# Altium schematic sheet Power_Supply.SchDoc
size 431 x 279 mm; SheetNumber: 6; SheetTotal: 6
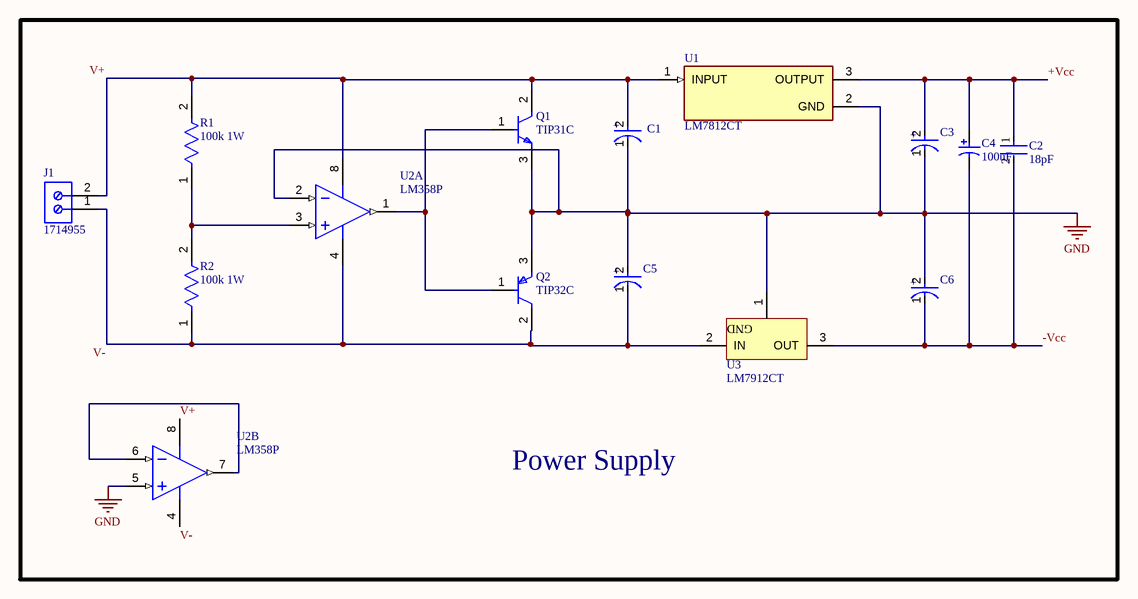
[diagram p0: Power_Supply.SchDoc]

## Parts
C1  EEUFC1H4R7B  [FP-RAD-TH-D_5_0_5-L_11_1-MFG]  (value not drawn)
C2  18pF  [FP-F471K33Y5RP6UK5R-MFG]
C3  EEUFC1H4R7B  [FP-RAD-TH-D_5_0_5-L_11_1-MFG]  (value not drawn)
C4  100uF  [CAPPR65-350-1150X800X1250]
C5  EEUFC1H4R7B  [FP-RAD-TH-D_5_0_5-L_11_1-MFG]  (value not drawn)
C6  EEUFC1H4R7B  [FP-RAD-TH-D_5_0_5-L_11_1-MFG]  (value not drawn)
J1  1714955  [PHOE-1714955_V]
Q1  TIP31C  [FP-TO-220-P0A0015988-MFG]
Q2  TIP32C  [FP-TO-220-P0A0015988-MFG]
R1  100k 1W  [FP-RR01-MFG]
R2  100k 1W  [FP-RR01-MFG]
U1  LM7812CT  [FP-TO220B03-MFG]
U2  LM358P  [P0008A]  (parts A,B of 2)
U3  LM7912CT  [NDE0003A]

## Blocks framed on the sheet
Power Supply: C1-C6 J1 Q1 Q2 R1 R2 U1-U3

## Nets
GND: C1.1(C) C3.1(C) C5.2(A) C6.2(A) Q1.3(E) Q2.3(E) U1.2(GND) U2.2(1IN-) U2.5(2IN+) U3.1(GND)
+Vcc: C2.1 C3.2(A) C4.1 U1.3(OUTPUT)
-Vcc: C2.2 C4.2 C6.1(C) U3.3(OUT)
V+: C1.2(A) J1.2 Q1.2(C) R1.2 U1.1(INPUT) U2.8(VCC)
V-: C5.1(C) J1.1 Q2.2(C) R2.1 U2.4(GND) U3.2(IN)
NetQ1_1: Q1.1(B) Q2.1(B) U2.1(1OUT)
NetR1_1: R1.1 R2.2 U2.3(1IN+)
NetU2_6: U2.6(2IN-) U2.7(2OUT)

## Notes on the sheet
- DWG. NO.
- REV.
- SHT.
- THIS DOCUMENT AND THE DATA DISCLOSED HEREIN OR HEREWITH IS THE PROPERTY OF ALTIUM LIMITED AND MAY BE FREELY DISTRIBUTED IN WHOLE. NO RIGHTS ARE RESERVED OR EXPRESS OR IMPLIED WARANTEE GIVEN.
- REVISION
- DESCRIPTION
- DATE
- APPROVED
- ENG:
- APPROVALS
- PROJECT
- DSN:
- CHK:
- REFERENCE DOCUMENTS
- PROJECT REVISION:
- TITLE
- DOCUMENT REVISION:
- DESIGN ITEM:
- BOM:
- FAB DWG:
- PCB DWG:
- ASSY DWG:
- SCALE:
- SIZE
- B
- CAGE CODE
- FILE NAME
- DWG NO.
- SHEET
- OF
- REV
- (in symbol CMP-05427-000609-1) +

## Library data of the parts
C1 C3 C5 C6 = CMP-05427-000609-1: Aluminum Electrolytic Capacitors (Radial Lead Type) AEC-Q200 Qualified 4.7uF ±20% 50V; Impedance: 1.3R; Life (Hours): 1000Hour; Polarity: Polar; Lead Diameter: 0.5mm; Ripple Current: 95mA; Ratings: AEC-Q200; Voltage Rating (DC): 50V; Voltage Rating: 50V; Lead Pitch: 5mm; Features: General Purpose; Height: 11mm; Radiation Hardening: No; Diameter: 5mm; Termination: Radial; Length: 11mm; Min Operating Temperature: -55°C; Height - Seated (Max): 0.472inch; Packaging: Tape and Reel; Max Operating Temperature: 105°C; ESR (Equivalent Series Resistance): 1.3R; RoHS Compliant: Yes; Package Quantity: 2000; Mount: Through Hole; Tolerance: 20%; Series: FC; Case/Package: Radial; Contact Plating: Tin
C2 = CMP-02417-000080-1: CAP CER 470PF 2KV Y5R RADIAL; Tolerance: 10%; Dielectric Material: Ceramic; Insulation Resistance: 10GR; Lead/Base Style: Kinked; Lead Diameter: 0.8mm; Series: F; Depth: 5mm; Package Quantity: 1500; Resistor Type: Ceramic; Construction: RADIAL; Min Operating Temperature: -30°C; Mount: Through Hole; Radiation Hardening: No; Voltage: 2kV; Voltage Rating: 2kV; Max Operating Temperature: 125°C; Termination: Radial; RoHS Compliant: Yes; Lead Pitch: 5mm; Capacitance: 470pF; Packaging: Tape and Reel; Length: 8.5mm; Case/Package: Radial; Dielectric: Y5R
C4 = CMP-1665-00042-2: Aluminum Electrolytic Capacitor, 100 uF, +/- 20%, 50 V, -40 to 85 degC, 2-Pin THD, RoHS, Bulk; Manufacturer: Panasonic; Lead Diameter: 0.6mm; Dielectric Material: Aluminium; Voltage Rating (DC): 50V; Ripple Current (AC): 250mA; Polarity: Polar; Leakage Current: 3uA; Life (Hours): 2000Hour; Lead/Base Style: Straight; Dissipation Factor: 0.12%; Radiation Hardening: No; Height: 11.5mm; Package Quantity: 200; Package Reference: CAPPR65-350-1150X800X1250; Min Operating Temperature: -40degC; Mount: ThroughHole; Package Description: 2-Pin Radial Lead, Dia 8 mm, Height 12.5 mm; Case/Package: Radial; Diameter: 8mm; Voltage Rating: 50V; Length: 11.5mm; REACH SVHC: NoSVHC; Height - Seated (Max): 0.492inch; Datasheet URL: https://industrial.panasonic.com/cdbs/www-data/pdf/RDF0000/ABA0000C1218.pdf; RoHSCompliant: true; Ripple Current: 250mA; Lead Free: LeadFree; Voltage: 50V; Manufacturer URL: http://www.panasonic.com/; Number of Pins: 2; Datasheet Version: Rev. 05, 10/2016; Packaging: Bulk; Termination: Radial; Max Operating Temperature: 85degC; Tolerance: 20%; Capacitance: 100uF; Lead Pitch: 3.5mm
J1 = CMP-2000-05797-1: PC Terminal Block, Pitch 6.35 mm, 1 x 2 Position, Height 21.5 mm, Tail Lenght 5.1 mm, RoHS, Bulk; Manufacturer: Phoenix Contact; Package Description: PC Terminal Block, Pitch 6.35 mm, 1 x 2 Position, Height 21.5 mm, Tail Lenght 5.1 mm; Datasheet URL: http://media.digikey.com/pdf/Data%20Sheets/Phoenix%20Contact%20PDFs/1714955.pdf; Package Reference: 1714955; Manufacturer URL: http://www.phoenixcontact.com/; Datasheet Version: 02/2010; Mounting Technology: ThroughHole
Q1 = CMP-12195-000001-1: TRANS NPN 100V 3A TO-220; Manufacturer: STMicroelectronics; Hfe Max: 50; Number Of Npn: 1; Max Junction Temp: +150°C; Standoff Height: 3.5mm; Emitter Base Voltage: 5V; Collector Emitter Saturation Voltage: 1.2V; Power Dissipation: 2W; Hfe Testvce: 4V; Hfe Min: 10; Device Class L2: Transistors; ComponentLink2URL: https://www.st.com/resource/en/datasheet/tip31c.pdf; Device Class L1: Discrete Semiconductors; Digikey Description: TRANS NPN 100V 3A TO-220; Max Collector Current: 3A; RoHS: TRUE; Height: 19.68mm; Mouser Description: Bipolar Transistors - BJT NPN Gen Pur Power; Number Of Elements: 1; Package: TO-220-P0A0015988; Temperature: to +150°C; Octopart: https://octopart.com/tip31c-stmicroelectronics-15555; Manufacturer Part Number: TIP31C; Category: Trans; Hfe Testic: 3A; Lead Free: Yes; Collector Base Voltage: 100V; Device Class L3: BJTs; Collector Emitter Voltage: 100V; Automotive: No; ComponentLink2Description: Datasheet; Temperature Range High: +150°C
Q2 = CMP-12195-000005-1: TRANS PNP 100V 3A TO-220; Manufacturer: STMicroelectronics; Standoff Height: 3.5mm; Number Of Pnp: 1; Max Collector Current: -3A; Emitter Base Voltage: -5V; Collector Emitter Voltage: -100V; Hfe Testvce: -4V; Hfe Max: 50; Collector Emitter Saturation Voltage: -1.2V; Power Dissipation: 2W; Max Junction Temp: +150°C; Hfe Min: 10; Device Class L3: BJTs; Mouser Description: Original ST Microelectronics Transistor, 100V, 3A, .22 Ohm, TO-220 Package; ComponentLink2Description: Datasheet; Device Class L1: Discrete Semiconductors; Automotive: No; Number Of Elements: 1; Category: Trans; Collector Base Voltage: -100V; Package: TO-220-P0A0015988; Height: 19.68mm; Lead Free: Yes; ComponentLink2URL: https://www.st.com/resource/en/datasheet/tip32c.pdf; Hfe Testic: -3A; RoHS: TRUE; Temperature Range High: +150°C; Temperature: to +150°C; Device Class L2: Transistors; Digikey Description: TRANS PNP 100V 3A TO-220; Octopart: https://octopart.com/tip32c-stmicroelectronics-353617; Manufacturer Part Number: TIP32C
R1 R2 = CMP-03212-000008-1: RES 100K OHM 5% 1W AXIAL; Number of Resistors: 1; Temperature Coefficient: 300ppm/°C; Voltage Rating: 350V; Resistance: 100kR; Package Quantity: 5000; Power Rating: 1W; Packaging: Ammo Pack; Min Operating Temperature: -55°C; Number of Terminations: 2; Resistor Type: Power resistor; Length: 6.8mm; ELV: Compliant; Mount: Axial; RoHS Compliant: Yes; Case/Package: Metal; Diameter: 2.6mm; Termination: Axial; Series: RR; Max Operating Temperature: 155°C; Tolerance: 5%
U1 = CMP-07128-000015-1: IC REG LINEAR 12V 1A TO220-3; Obsolete Part: true; Manufacturer: ON Semiconductor; Nominal Supply Current: 5.1mA; Output Type: Fixed; Dropout Voltage: 2V; Max Supply Voltage: 35V; Accuracy Percentage: 4%; Standoff Height: 2.7mm; Number Of Outputs: 1; Octopart: https://octopart.com/lm7812ct-on+semiconductor-14383031; Output Current: 1A; ComponentLink2Description: Datasheet; Device Class L1: Integrated Circuits (ICs); Device Class L2: Power Management ICs; Temperature Range Low: -40°C; Category: IC; Package: TO220B03; Device Class L3: Voltage Regulators - Linear; RoHS: TRUE; Digikey Description: IC REG LINEAR 12V 1A TO220-3; Ipc Land Pattern Name: TO-220; Output Voltage: 12V; Temperature: -40°C to +125°C; Automotive: No; Temperature Range High: +125°C; ComponentLink2URL: https://www.mouser.in/datasheet/2/308/LM7812-1125088.pdf; Manufacturer Part Number: LM7812CT; Height: 20.4mm; Lead Free: Yes
U2 = CMP-2000-06549-1: Dual Operational Amplifier, 3 to 32 V, 0 to 70 degC, 8-Pin PDIP (P), RoHS, Tape and Reel; Manufacturer: Technik Industrial; Datasheet Version: Rev. T, 04/2015; Datasheet URL: http://www.ti.com/lit/ds/symlink/lm358.pdf; Manufacturer URL: http://www.technik.com.hk/; Package Description: 8-Pin Double In-line Package, Body 9.59 x 6.35 mm, Pitch 2.54 mm; Mounting Technology: ThroughHole; Package URL: http://www.ti.com/lit/ml/mpdi001b/mpdi001b.pdf; Package Reference: P8
U3 = CMP-0062-02472-3: 3-Terminal Negative Regulator, 3-pin TO-220; Manufacturer: Texas Instruments; CompType: LDO IC; PowerWise: N; PackageTopMarking: NSUZXYTTE#*LM7912CT; PinCount: 3; RoHS: N; PackageDescription: TO-220, Molded, 3 Lead, Straight; ComponentLink1URL: http://www.ti.com/general/docs/lit/getliterature.tsp?genericPartNumber=LM7912&fileType=pdf; PackageReference: NDE0003A; ComponentLink1Description: Datasheet URL